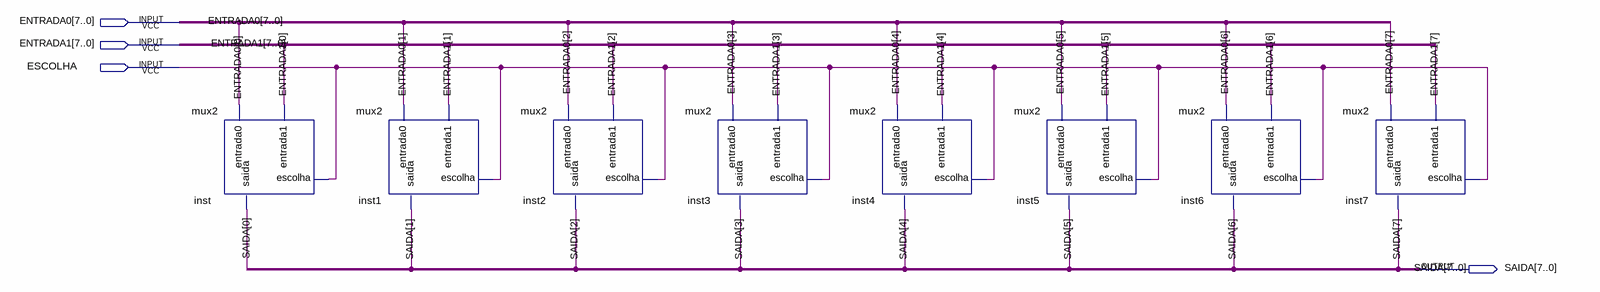
[diagram p0: schematic sheet]
// Quartus schematic mux2barramento.bdf as structural Verilog: 8 symbols, 4 pins
module mux2barramento (
  input  [7:0] ENTRADA0,
  input  [7:0] ENTRADA1,
  input  ESCOLHA,
  output [7:0] SAIDA
);

  mux2 inst (.entrada0(ENTRADA0[0]), .entrada1(ENTRADA1[0]), .escolha(ESCOLHA), .saida(SAIDA[0]));
  mux2 inst1 (.entrada0(ENTRADA0[1]), .entrada1(ENTRADA1[1]), .escolha(ESCOLHA), .saida(SAIDA[1]));
  mux2 inst2 (.entrada0(ENTRADA0[2]), .entrada1(ENTRADA1[2]), .escolha(ESCOLHA), .saida(SAIDA[2]));
  mux2 inst3 (.entrada0(ENTRADA0[3]), .entrada1(ENTRADA1[3]), .escolha(ESCOLHA), .saida(SAIDA[3]));
  mux2 inst4 (.entrada0(ENTRADA0[4]), .entrada1(ENTRADA1[4]), .escolha(ESCOLHA), .saida(SAIDA[4]));
  mux2 inst5 (.entrada0(ENTRADA0[5]), .entrada1(ENTRADA1[5]), .escolha(ESCOLHA), .saida(SAIDA[5]));
  mux2 inst6 (.entrada0(ENTRADA0[6]), .entrada1(ENTRADA1[6]), .escolha(ESCOLHA), .saida(SAIDA[6]));
  mux2 inst7 (.entrada0(ENTRADA0[7]), .entrada1(ENTRADA1[7]), .escolha(ESCOLHA), .saida(SAIDA[7]));
endmodule
